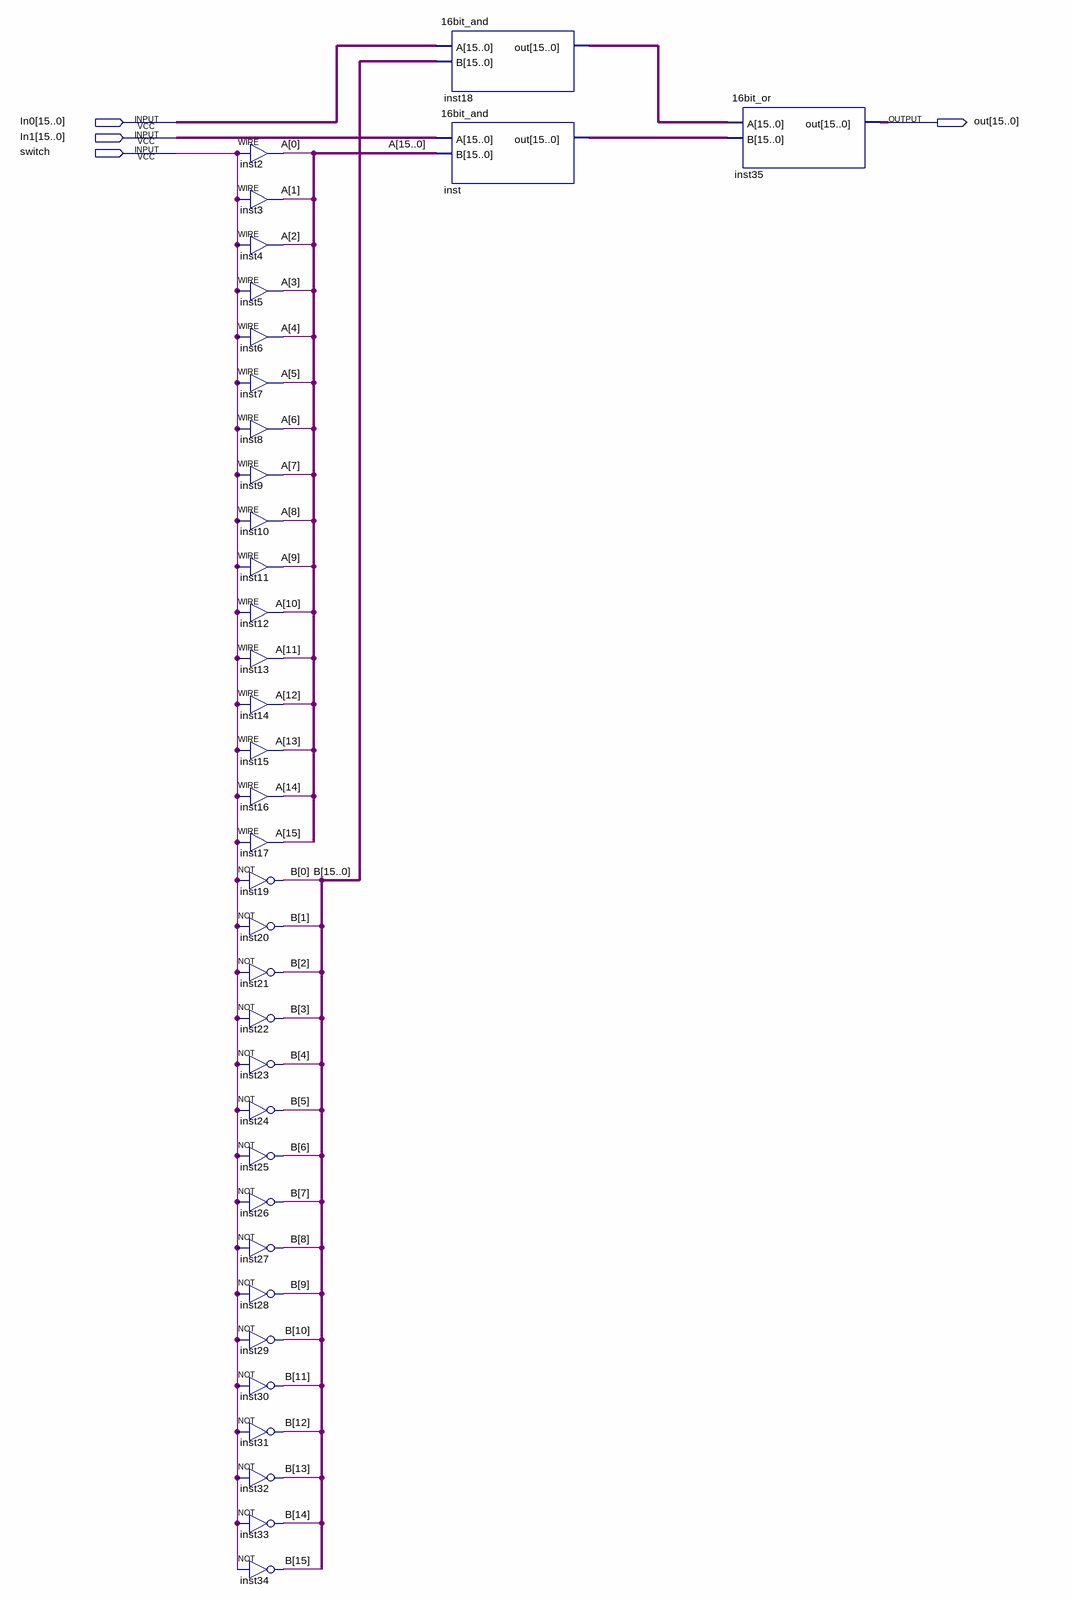
[diagram p0: schematic sheet]
// Quartus schematic simplemultiplexor.bdf as structural Verilog: 35 symbols, 4 pins
module simplemultiplexor (
  input  [15:0] In0,
  input  [15:0] In1,
  input  switch,
  output [15:0] out
);

  wire [15:0] A, B, inst18_out, inst_out;

  assign A[0] = switch;  // WIRE inst2
  assign A[1] = switch;  // WIRE inst3
  assign A[2] = switch;  // WIRE inst4
  assign A[3] = switch;  // WIRE inst5
  assign A[4] = switch;  // WIRE inst6
  assign A[5] = switch;  // WIRE inst7
  assign A[6] = switch;  // WIRE inst8
  assign A[7] = switch;  // WIRE inst9
  assign A[8] = switch;  // WIRE inst10
  assign A[9] = switch;  // WIRE inst11
  assign A[10] = switch;  // WIRE inst12
  assign A[11] = switch;  // WIRE inst13
  assign A[12] = switch;  // WIRE inst14
  assign A[13] = switch;  // WIRE inst15
  assign A[14] = switch;  // WIRE inst16
  assign A[15] = switch;  // WIRE inst17
  not inst19 (B[0], switch);
  not inst20 (B[1], switch);
  not inst21 (B[2], switch);
  not inst22 (B[3], switch);
  not inst23 (B[4], switch);
  not inst24 (B[5], switch);
  not inst25 (B[6], switch);
  not inst26 (B[7], switch);
  not inst27 (B[8], switch);
  not inst28 (B[9], switch);
  not inst29 (B[10], switch);
  not inst30 (B[11], switch);
  not inst31 (B[12], switch);
  not inst32 (B[13], switch);
  not inst33 (B[14], switch);
  not inst34 (B[15], switch);
  \16bit_and  inst18 (.A(In0), .B(B), .out(inst18_out));
  \16bit_and  inst (.A(In1), .B(A), .out(inst_out));
  \16bit_or  inst35 (.A(inst18_out), .B(inst_out), .out(out));
endmodule
